# Altium schematic sheet fulladd4_tb.SchDoc
size 111 x 66 mm
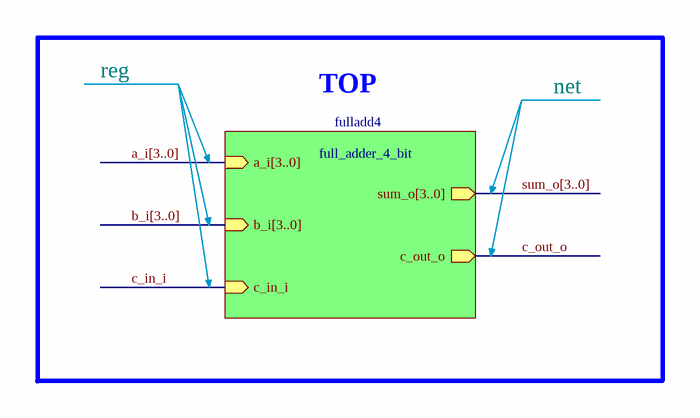
[diagram p0: fulladd4_tb.SchDoc]

## Sub-sheets
fulladd4 = full_adder_4_bit.SchDoc: a_i[3..0] (in), b_i[3..0] (in), c_in_i (in), sum_o[3..0] (out), c_out_o (out)  | ComponentName: full_adder_4_bit

## Nets
c_in_i: sheet fulladd4/c_in_i
c_out_o: sheet fulladd4/c_out_o

## Buses and harness runs
bus a_i[3..0] = sheet fulladd4/a_i[3..0]
bus b_i[3..0] = sheet fulladd4/b_i[3..0]
bus sum_o[3..0] = sheet fulladd4/sum_o[3..0]

## Notes on the sheet
- reg
- TOP
- net